# Altium schematic sheet XL_N76E003K3._POWER_V17.SchDoc
size A4
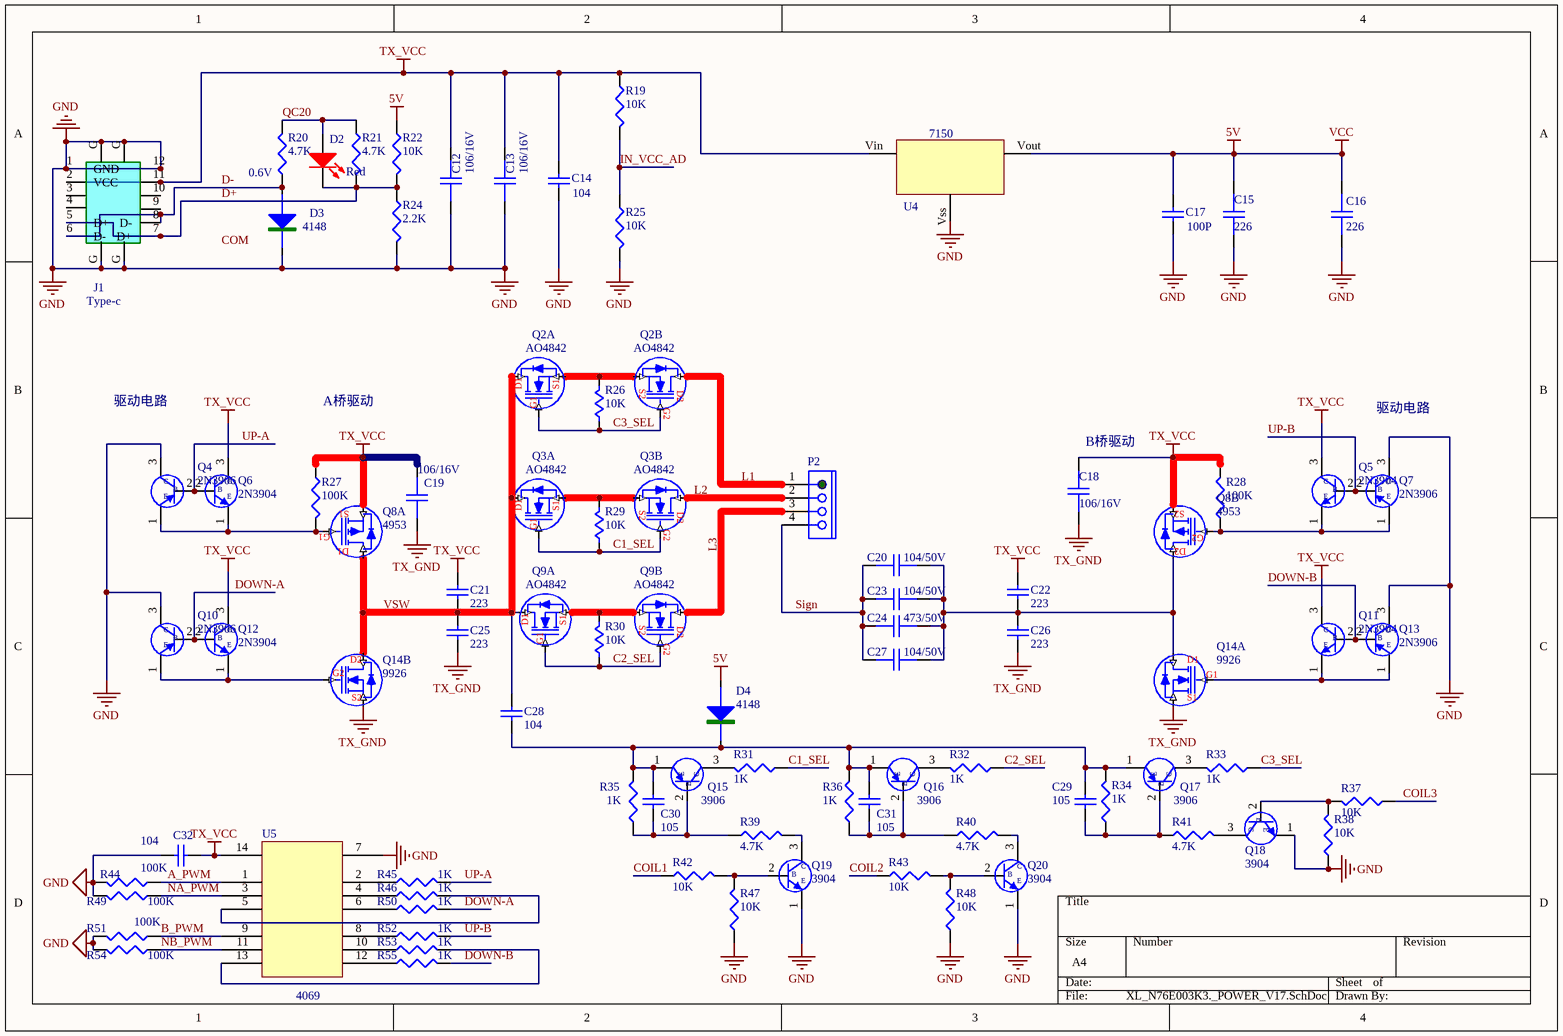
[diagram p0: XL_N76E003K3._POWER_V17.SchDoc]

## Parts
C12  106/16V  [C0805]
C13  106/16V  [C0805]
C14  104  [C0402]
C15  226  [C0805]
C16  226  [C0805]
C17  100P  [C0402]
C18  106/16V  [C0805]
C19  106/16V  [C0805]
C20  104/50V  [C1206]
C21  223  [C1206]
C22  223  [C1206]
C23  104/50V  [C1206]
C24  473/50V  [C1206]
C25  223  [C0402]
C26  223  [C1206]
C27  104/50V  [C1206]
C28  104  [C0402]
C29  105  [C0402]
C30  105  [C0402]
C31  105  [C0402]
C32  104  [C0402]
D2  Red  [LED0603]
D3  4148  [SOD323]
D4  4148  [SOD323]
J1  Type-c  [USB -MRO17]
P2  (no value)  [USB -MRO18-2]
Q2  AO4842  [SOP8D]  (parts A,B of 2)
Q3  AO4842  [SOP8D]  (parts A,B of 2)
Q4  2N3906  [SOT-23]
Q5  2N3904  [SOT-23]
Q6  2N3904  [SOT-23]
Q7  2N3906  [SOT-23]
Q8  4953  [SOP8D]  (parts A,B of 2)
Q9  AO4842  [SOP8D]  (parts A,B of 2)
Q10  2N3906  [SOT-23]
Q11  2N3904  [SOT-23]
Q12  2N3904  [SOT-23]
Q13  2N3906  [SOT-23]
Q14  9926  [SOP8D]  (parts A,B of 2)
Q15  3906  [SOT-23]
Q16  3906  [SOT-23]
Q17  3906  [SOT-23]
Q18  3904  [SOT-23]
Q19  3904  [SOT-23]
Q20  3904  [SOT-23]
R19  10K  [R0402]
R20  4.7K  [R0402]
R21  4.7K  [R0402]
R22  10K  [R0402]
R24  2.2K  [R0402]
R25  10K  [R0402]
R26  10K  [R0402]
R27  100K  [R0402]
R28  100K  [R0402]
R29  10K  [R0402]
R30  10K  [R0402]
R31  1K  [R0402]
R32  1K  [R0402]
R33  1K  [R0402]
R34  1K  [R0402]
R35  1K  [R0402]
R36  1K  [R0402]
R37  10K  [R0402]
R38  10K  [R0402]
R39  4.7K  [R0402]
R40  4.7K  [R0402]
R41  4.7K  [R0402]
R42  10K  [R0402]
R43  10K  [R0402]
R44  100K  [R0402]
R45  1K  [R0402]
R46  1K  [R0402]
R47  10K  [R0402]
R48  10K  [R0402]
R49  100K  [R0402]
R50  1K  [R0402]
R51  100K  [R0402]
R52  1K  [R0402]
R53  1K  [R0402]
R54  100K  [R0402]
R55  1K  [R0402]
U4  7150  [SOT-23-7150]
U5  4069  [SOP14]

## Nets
5V: C15.1 C16.2 C17.1 D4.1 R22.2 U4.Vout  [also labelled VCC]
GND: C12.2 C13.2 C14.2 C15.2 C16.1 C17.2 C32.1 D3.2 J1.1(GND) J1.12 J1.G Q4.3(C) Q7.3(C) Q10.3(C) Q13.3(C) Q18.1(E) Q19.1(E) Q20.1(E) R24.1 R25.1 R38.1 R44.2 R47.1 R48.1 R49.2 R51.2 R54.2 U4.Vss U5.7
TX_GND: C18.2 C19.2 C25.1 C26.1 Q14.E1(S1) Q14.E2(S2)
TX_VCC: C12.1 C13.1 C14.1 C18.1 C19.1 C21.2 C22.2 C32.2 J1.2(VCC) J1.11 Q5.3(C) Q6.3(C) Q8.E1(S1) Q8.E2(S2) Q11.3(C) Q12.3(C) R19.2 R27.1 R28.2 U4.Vin U5.14
A_PWM: R44.1 U5.1
B_PWM: R51.1 U5.9
C1_SEL: Q3.B1(G1) Q3.B2(G2) R29.1 R31.1
C2_SEL: Q9.B1(G1) Q9.B2(G2) R30.1 R32.1
C3_SEL: Q2.B1(G1) Q2.B2(G2) R26.1 R33.1
COIL1: R42.1
COIL2: R43.1
COIL3: R37.1
D+: D2.2(K) J1.5(D+) J1.7(D+) R21.1 R22.1 R24.2
D-: D3.1 J1.6(D-) J1.8(D-) R20.2
DOWN-A: Q10.2(B) Q12.2(B) R50.2
DOWN-B: Q11.2(B) Q13.2(B) R55.2
IN_VCC_AD: R19.1 R25.2
L1: P2.1 Q2.C2(D2)
L2: P2.2 Q3.C2(D2)
L3: P2.3 Q9.C2(D2)
NA_PWM: R49.1 U5.3
NB_PWM: R54.1 U5.11
QC20: D2.1(A) R20.1 R21.2
Sign: C20.1 C23.1 C24.1 C27.1 P2.4
UP-A: Q4.2(B) Q6.2(B) R45.2
UP-B: Q5.2(B) Q7.2(B) R52.2
VSW: C21.1 C25.2 C28.1 Q2.C1(D1) Q3.C1(D1) Q8.C1(D1) Q9.C1(D1) Q14.C2(D2)
NetC20_2: C20.2 C22.1 C23.2 C24.2 C26.2 C27.2 Q8.C2(D2) Q14.C1(D1)
NetC28_2: C28.2 C29.1 C30.1 C31.1 D4.2 Q15.1(E) Q16.1(E) Q17.1(E) R34.2 R35.2 R36.2
NetC29_2: C29.2 Q17.2(B) R34.1 R41.1
NetC30_2: C30.2 Q15.2(B) R35.1 R39.1
NetC31_2: C31.2 Q16.2(B) R36.1 R40.1
NetQ2_E1: Q2.E1(S1) Q2.E2(S2) R26.2
NetQ3_E1: Q3.E1(S1) Q3.E2(S2) R29.2
NetQ4_1: Q4.1(E) Q6.1(E) Q8.B1(G1) R27.2
NetQ5_1: Q5.1(E) Q7.1(E) Q8.B2(G2) R28.1
NetQ9_E1: Q9.E1(S1) Q9.E2(S2) R30.2
NetQ10_1: Q10.1(E) Q12.1(E) Q14.B2(G2)
NetQ11_1: Q11.1(E) Q13.1(E) Q14.B1(G1)
NetQ15_3: Q15.3(C) R31.2
NetQ16_3: Q16.3(C) R32.2
NetQ17_3: Q17.3(C) R33.2
NetQ18_2: Q18.2(B) R37.2 R38.2
NetQ18_3: Q18.3(C) R41.2
NetQ19_2: Q19.2(B) R42.2 R47.2
NetQ19_3: Q19.3(C) R39.2
NetQ20_2: Q20.2(B) R43.2 R48.2
NetQ20_3: Q20.3(C) R40.2
NetR45_1: R45.1 U5.2
NetR46_1: R46.1 U5.4
NetR46_2: R46.2 U5.5
NetR50_1: R50.1 U5.6
NetR52_1: R52.1 U5.8
NetR53_1: R53.1 U5.10
NetR53_2: R53.2 U5.13
NetR55_1: R55.1 U5.12

Not connected (* = marked no-connect by the designer): J1 3 4 9 10

## Notes on the sheet
- 0.6V
- 혜땡든쨌
- A픕혜땡
- (near C18) B픕혜땡
- Labels drawn without touching a wire or pin: COM

## Library data of the parts
C12 C13 C15 C16 C18-C20 C23 C24 C27 = CH
C14 C28 C32 = Cap: Capacitor; Published: 8-Jun-2000; LatestRevisionDate: 17-Jul-2002; LatestRevisionNote: Re-released for DXP Platform.; Publisher: Altium Limited; Value: 104
C17 C21 C22 C25 C26 C29-C31 = Cap: Capacitor; Value: 104; Published: 8-Jun-2000; LatestRevisionDate: 17-Jul-2002; LatestRevisionNote: Re-released for DXP Platform.; Publisher: Altium Limited
D2 = LED02
D3 D4 = D0: 1N4001
J1 = USP12P
P2 = CON4
Q2 Q3 Q9 Q14 = MOSFETN2
Q4 Q7 Q10 Q13 Q15-Q17 = PNP01
Q5 Q6 Q11 Q12 Q18-Q20 = NPN01
Q8 = MOSFETP2
R19-R22 R24 R25 R27 R28 R37-R44 R47-R49 R51 R54 = R: 1K
R26 R29 R30 = Res01
R31-R36 R45 R46 R50 R52 R53 R55 = R
U4 = VOLTREG
U5 = CD4069